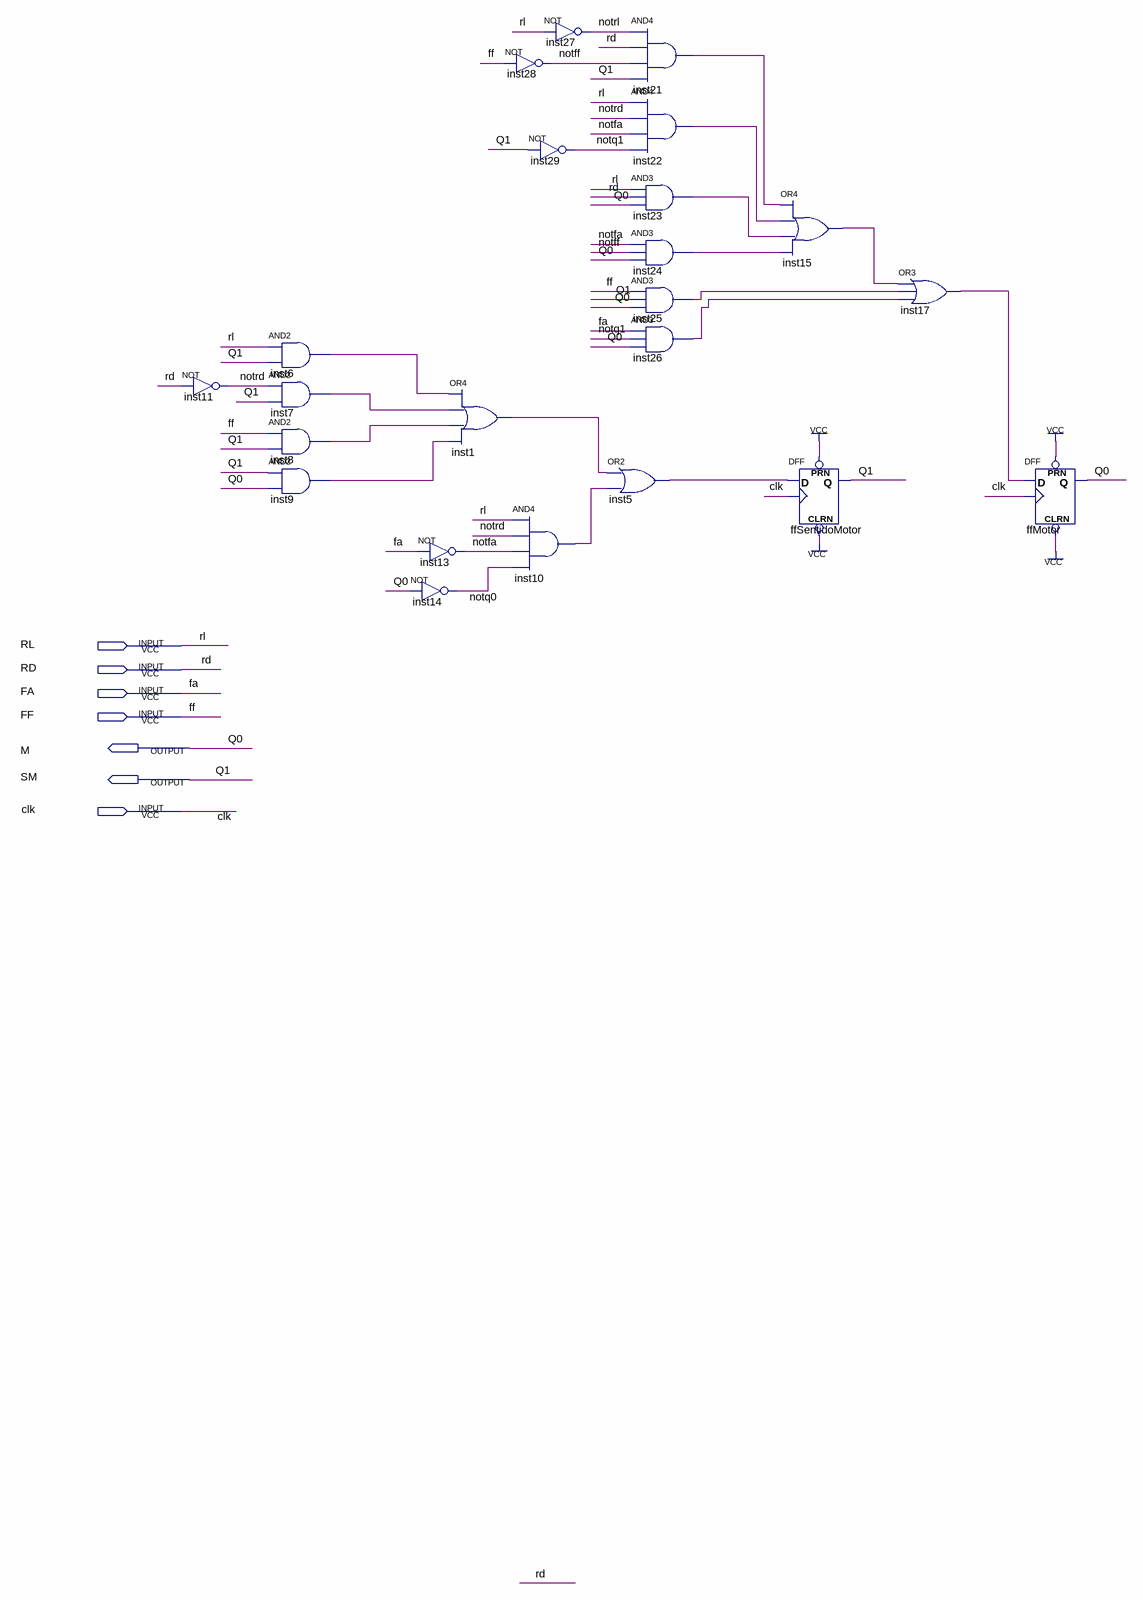
[diagram p0: schematic sheet]
// Quartus schematic controleAutomatico.bdf as structural Verilog: 23 symbols, 7 pins
module controleAutomatico (
  input  RL,
  input  RD,
  input  FA,
  input  FF,
  input  clk,
  output M,
  output SM
);

  wire inst1_out, inst5_out, inst6_out, inst7_out, inst8_out, inst9_out, inst10_out, inst15_out, inst17_out,
       inst21_out, inst22_out, inst23_out, inst24_out, inst25_out, inst26_out, notfa, notff, notq0, notq1,
       notrd, notrl;

  not inst11 (notrd, RD);
  and inst6 (inst6_out, RL, SM);
  and inst7 (inst7_out, notrd, SM);
  and inst8 (inst8_out, FF, SM);
  and inst9 (inst9_out, SM, M);
  not inst13 (notfa, FA);
  not inst14 (notq0, M);
  or inst1 (inst1_out, inst6_out, inst7_out, inst8_out, inst9_out);
  not inst27 (notrl, RL);
  not inst28 (notff, FF);
  not inst29 (notq1, SM);
  and inst10 (inst10_out, RL, notrd, notfa, notq0);
  or inst5 (inst5_out, inst1_out, inst10_out);
  and inst21 (inst21_out, notrl, RD, notff, SM);
  and inst22 (inst22_out, RL, notrd, notfa, notq1);
  and inst23 (inst23_out, RL, RD, M);
  and inst24 (inst24_out, notfa, notff, M);
  and inst25 (inst25_out, FF, SM, M);
  and inst26 (inst26_out, FA, notq1, M);
  or inst15 (inst15_out, inst21_out, inst22_out, inst23_out, inst24_out);
  DFF ffSentidoMotor (.CLRN(1'b1), .CLK(clk), .D(inst5_out), .PRN(1'b1), .Q(SM));
  or inst17 (inst17_out, inst15_out, inst25_out, inst26_out);
  DFF ffMotor (.CLRN(1'b1), .CLK(clk), .D(inst17_out), .PRN(1'b1), .Q(M));

  // Other names for the same wires on the sheet: Q0 = M; Q1 = SM
endmodule
